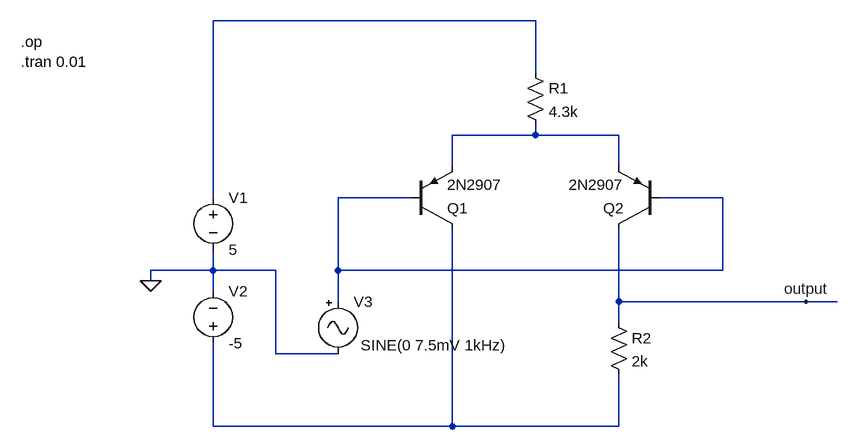
[diagram p0: schematic LTP.asc]
LTP.asc, the LTspice schematic file:
Version 4
SHEET 1 900 680
WIRE 432 -16 -64 -16
WIRE 432 64 432 -16
WIRE 432 160 432 144
WIRE 432 160 304 160
WIRE 560 160 432 160
WIRE 304 208 304 160
WIRE 560 208 560 160
WIRE -64 256 -64 -16
WIRE 240 256 128 256
WIRE 720 256 624 256
WIRE -64 368 -64 336
WIRE -64 368 -160 368
WIRE 32 368 -64 368
WIRE 128 368 128 256
WIRE 720 368 720 256
WIRE 720 368 128 368
WIRE -160 384 -160 368
WIRE -64 400 -64 368
WIRE 128 416 128 368
WIRE 560 416 560 304
WIRE 848 416 560 416
WIRE 896 416 848 416
WIRE 560 448 560 416
WIRE 32 496 32 368
WIRE 128 496 32 496
WIRE -64 608 -64 480
WIRE 304 608 304 304
WIRE 304 608 -64 608
WIRE 560 608 560 528
WIRE 560 608 304 608
FLAG -160 384 0
FLAG 848 416 output
SYMBOL pnp 240 304 M180
SYMATTR InstName Q1
SYMATTR Value 2N2907
SYMBOL pnp 624 304 R180
SYMATTR InstName Q2
SYMATTR Value 2N2907
SYMBOL voltage -64 240 R0
SYMATTR InstName V1
SYMATTR Value 5
SYMBOL voltage -64 496 M180
WINDOW 0 24 96 Left 2
WINDOW 3 24 16 Left 2
SYMATTR InstName V2
SYMATTR Value -5
SYMBOL res 416 48 R0
SYMATTR InstName R1
SYMATTR Value 4.3k
SYMBOL Misc/signal 128 400 R0
WINDOW 3 35 83 Left 2
SYMATTR Value SINE(0 7.5mV 1kHz)
SYMATTR InstName V3
SYMBOL res 544 432 R0
SYMATTR InstName R2
SYMATTR Value 2k
TEXT -360 16 Left 2 !.op\n.tran 0.01

The netlist it stands for:
* LTP.asc
Q1 N004 N003 N002 0 2N2907
Q2 output N003 N002 0 2N2907
V1 N001 0 5
V2 N004 0 -5
R1 N001 N002 4.3k
V3 N003 0 SINE(0 7.5mV 1kHz)
R2 output N004 2k
.model NPN NPN
.model PNP PNP
.lib standard.bjt
.op
.tran 0.01
.backanno
.end